# Altium schematic sheet FTDI.SchDoc
size A4; SheetNumber: 5; SheetTotal: 7
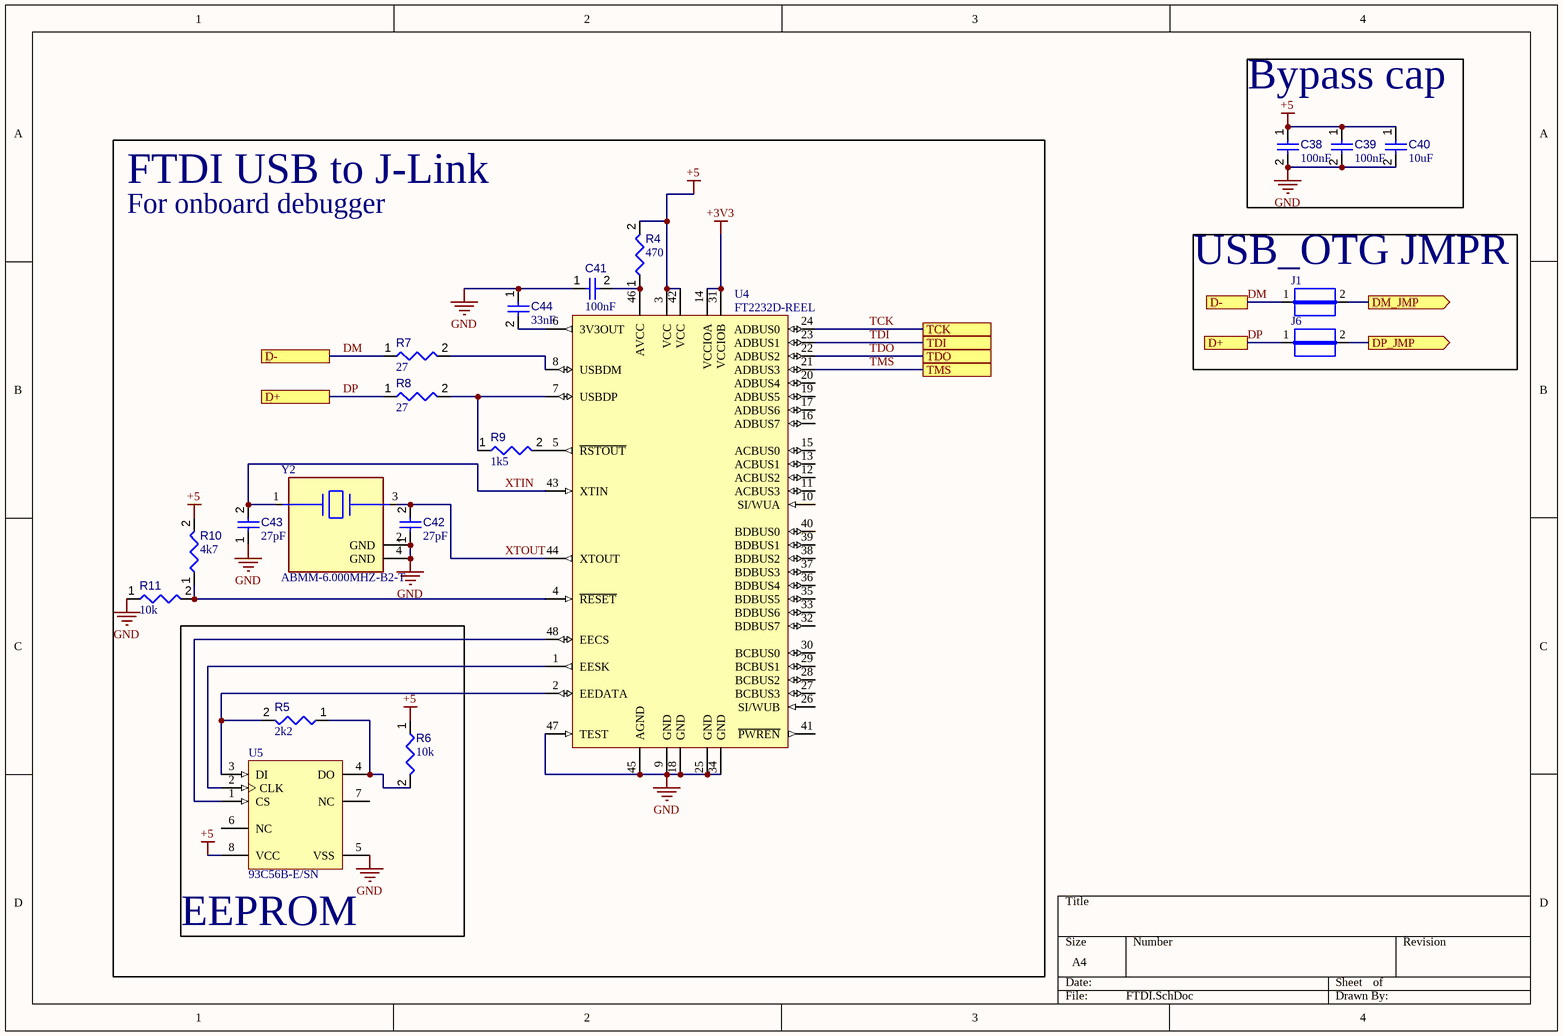
[diagram p0: FTDI.SchDoc]

## Parts
C38  value 100nF  [CAPC0603(1608)100_L]  (hidden comment: Capacitor 470nF +/-20% 25V 0603)
C39  value 100nF  [CAPC0603(1608)100_L]  (hidden comment: Capacitor 470nF +/-20% 25V 0603)
C40  value 10uF  [CAPC0603(1608)100_L]  (hidden comment: Capacitor 470nF +/-20% 25V 0603)
C41  value 100nF  [CAPC0603(1608)100_L]  (hidden comment: Capacitor 470nF +/-20% 25V 0603)
C42  value 27pF  [CAPC0603(1608)100_L]  (hidden comment: Capacitor 470nF +/-20% 25V 0603)
C43  value 27pF  [CAPC0603(1608)100_L]  (hidden comment: Capacitor 470nF +/-20% 25V 0603)
C44  value 33nF  [CAPC0603(1608)100_L]  (hidden comment: Capacitor 470nF +/-20% 25V 0603)
J1  JUMPER  [JUMPER]  (value not drawn)
J6  JUMPER  [JUMPER]  (value not drawn)
R4  value 470  [RESC0603(1608)_L]  (hidden comment: 120R3J)
R5  value 2k2  [RESC0603(1608)_L]  (hidden comment: 120R3J)
R6  value 10k  [RESC0603(1608)_L]  (hidden comment: 120R3J)
R7  value 27  [RESC0603(1608)_L]  (hidden comment: 120R3J)
R8  value 27  [RESC0603(1608)_L]  (hidden comment: 120R3J)
R9  value 1k5  [RESC0603(1608)_L]  (hidden comment: 120R3J)
R10  value 4k7  [RESC0603(1608)_L]  (hidden comment: 120R3J)
R11  value 10k  [RESC0603(1608)_L]  (hidden comment: 120R3J)
U4  FT2232D-REEL  [LQFP-48_L]
U5  93C56B-E/SN  [SOIC-SN8_M]
Y2  ABMM-6.000MHZ-B2-T  [FP-ABMM-MFG]

## Blocks framed on the sheet
Bypass cap: C38-C40
FTDI USB to J-Link: C41-C44 R4 R7-R11 U4 Y2
USB_OTG JMPR: J1 J6
EEPROM: R5 R6 U5

## Ports
D+, D-, DM_JMP (out), DP_JMP (out), TCK, TDI, TDO, TMS

## Nets
+3V3: U4.14(VCCIOA) U4.31(VCCIOB)
+5: C38.1 C39.1 C40.1 R4.2 R6.1 R10.2 U4.3(VCC) U4.42(VCC) U5.8(VCC)
GND: C38.2 C39.2 C40.2 C41.1 C42.1 C43.1 C44.1 R11.1 U4.9(GND) U4.18(GND) U4.25(GND) U4.34(GND) U4.45(AGND) U4.47(TEST) U5.5(VSS) Y2.2(GND) Y2.4(GND)
DM: J1.1 R7.1 ; port D-
DM_JMP: J1.2 ; port DM_JMP
DP: J6.1 R8.1 ; port D+
DP_JMP: J6.2 ; port DP_JMP
TCK: U4.24(ADBUS0) ; port TCK
TDI: U4.23(ADBUS1) ; port TDI
TDO: U4.22(ADBUS2) ; port TDO
TMS: U4.21(ADBUS3) ; port TMS
XTIN: C43.2 U4.43(XTIN) Y2.1
XTOUT: C42.2 U4.44(XTOUT) Y2.3
NetC41_2: C41.2 R4.1 U4.46(AVCC)
NetC44_2: C44.2 U4.6(3V3OUT)
NetR5_1: R5.1 R6.2 U5.4(DO)
NetR5_2: R5.2 U4.2(EEDATA) U5.3(DI)
NetR7_2: R7.2 U4.8(USBDM)
NetR8_2: R8.2 R9.1 U4.7(USBDP)
NetR9_2: R9.2 U4.5(~{RSTOUT})
NetR10_1: R10.1 R11.2 U4.4(~{RESET})
NetU4_1: U4.1(EESK) U5.2(CLK)
NetU4_48: U4.48(EECS) U5.1(CS)

Not connected (* = marked no-connect by the designer): U4 10(SI/WUA) 11(ACBUS3) 12(ACBUS2) 13(ACBUS1) 15(ACBUS0) 16(ADBUS7) 17(ADBUS6) 19(ADBUS5) 20(ADBUS4) 26(SI/WUB) 27(BCBUS3) 28(BCBUS2) 29(BCBUS1) 30(BCBUS0) 32(BDBUS7) 33(BDBUS6) 35(BDBUS5) 36(BDBUS4) 37(BDBUS3) 38(BDBUS2) 39(BDBUS1) 40(BDBUS0) 41(~{PWREN}); U5 6(NC) 7(NC)

## Notes on the sheet
- For onboard debugger

## Library data of the parts
C38-C44 = CMP-001-00077-3: Chip Capacitor, 470nF +/-20%, 25V, 0603, Thickness 1 mm; Tolerance: 10%; Max Operating Temperature: 85°C; Voltage Rating: 25V; Pins: 2; Case/Package: 0603; Mounting Technology: SMT; Min Operating Temperature: -55°C
J1 J6 = CMP-009-00061-2: Pins: 2
R4-R11 = CMP-009-00069-2: 120R 0.1W 5% 0603 (1608 Metric)  SMD; Power: 100mW; Mounting Technology: SMT; Tolerance: 5%; Case/Package: 0603; Pins: 2
U4 = CMP-0579-00002-1: FT2232D Dual USB to Serial UART/FIFO IC, -40 to +85 degC, 48-Pin LQFP, Pb-Free, Tape and Reel; Manufacturer: FTDI; ComponentLink1Description: Manufacturer URL; ComponentLink1URL: http://www.ftdichip.com/; PackageDescription: 48-Pin Thin Quad Flat Pack, 7 x 7 mm Body, 0.5 mm Pitch; PackageVersion: Apr-11; PartNumber: FT2232D-REEL; ComponentLink2URL: http://www.ftdichip.com/Support/Documents/DataSheets/ICs/DS_FT2232D.pdf; ComponentLink2Description: Datasheet; PackageReference: LQFP-48; DatasheetVersion: ver 2.05, Apr-2011
U5 = CMP-0162-00233-1: 2K, 128x16-bit, 5.0V Microwire Serial EEPROM, 8-Pin SOIC 150mil, Extended Temperature; Code_JEDEC: MS-012; Code_IPC: SOIC127P600-8; DatasheetVersion: revF, May-2008; PackageReference: SOIC-SN8; PackageDescription: 8-Lead Plastic Small Outline (SN) - Narrow, 3.90mm Body [SOIC]; PackageVersion: revBB, Aug-2009
Y2 = CMP-27762-012698-1: CRYSTAL 6.0000MHZ 18PF SMD; Frequency Tolerance: 20ppm; Frequency: 6MHz; Series Resistance: 70R; Operating Frequency: 6 MHz; Frequency Stability: 50ppm; Load Capacitance: 18pF; Min Operating Temperature: -20°C; Number of Pins: 4; Packaging: Tape and Reel; Max Operating Temperature: 70°C; Case/Package: SMD/SMT; Tolerance: 20ppm; Height: 0.051inch; Mount: Surface Mount; Width: 5mm; Lead Free: Lead Free; Series: ABMM; ESR (Equivalent Series Resistance): 70R; Length: 0.276inch; Termination: SMD/SMT; Package Quantity: 1000; Resistor Type: Ceramic